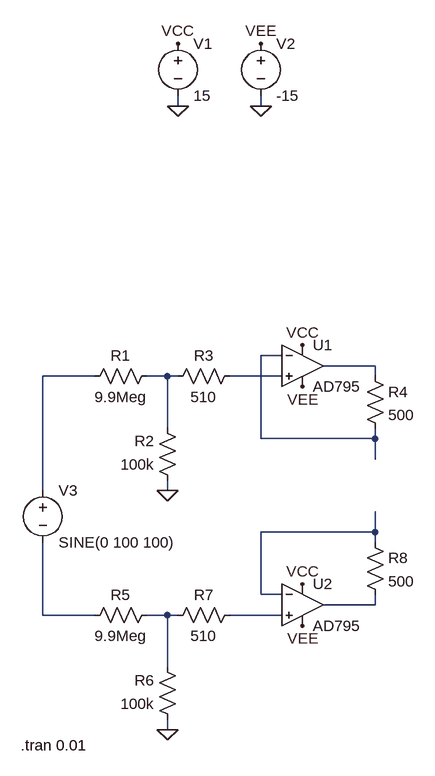
[diagram p0: schematic Draft1.asc]
Draft1.asc, the LTspice schematic file:
Version 4
SHEET 1 880 680
WIRE 32 -320 32 -336
WIRE 160 -320 160 -336
WIRE 192 64 160 64
WIRE 336 80 256 80
WIRE -96 96 -176 96
WIRE 16 96 -16 96
WIRE 32 96 16 96
WIRE 192 96 112 96
WIRE 336 96 336 80
WIRE 16 176 16 96
WIRE 160 192 160 64
WIRE 336 192 336 176
WIRE 336 192 160 192
WIRE 336 224 336 192
WIRE -176 272 -176 96
WIRE 16 272 16 256
WIRE 336 336 336 304
WIRE 336 336 160 336
WIRE 336 352 336 336
WIRE 160 432 160 336
WIRE 192 432 160 432
WIRE 336 448 336 432
WIRE 336 448 256 448
WIRE -176 464 -176 352
WIRE -96 464 -176 464
WIRE 16 464 -16 464
WIRE 32 464 16 464
WIRE 192 464 112 464
WIRE 16 544 16 464
WIRE 16 640 16 624
FLAG 32 -320 0
FLAG 160 -320 0
FLAG 32 -416 VCC
FLAG 224 48 VCC
FLAG 160 -416 VEE
FLAG 224 112 VEE
FLAG 16 272 0
FLAG 224 416 VCC
FLAG 224 480 VEE
FLAG 16 640 0
SYMBOL OpAmps\\AD795 224 16 R0
SYMATTR InstName U1
SYMBOL voltage 32 -432 R0
WINDOW 123 0 0 Left 0
WINDOW 39 0 0 Left 0
SYMATTR InstName V1
SYMATTR Value 15
SYMBOL voltage 160 -432 R0
WINDOW 123 0 0 Left 0
WINDOW 39 0 0 Left 0
SYMATTR InstName V2
SYMATTR Value -15
SYMBOL res 0 80 R90
WINDOW 0 0 56 VBottom 2
WINDOW 3 32 56 VTop 2
SYMATTR InstName R1
SYMATTR Value 9.9Meg
SYMBOL res 32 272 R180
WINDOW 0 36 76 Left 2
WINDOW 3 36 40 Left 2
SYMATTR InstName R2
SYMATTR Value 100k
SYMBOL res 16 112 R270
WINDOW 0 32 56 VTop 2
WINDOW 3 0 56 VBottom 2
SYMATTR InstName R3
SYMATTR Value 510
SYMBOL OpAmps\\AD795 224 384 R0
SYMATTR InstName U2
SYMBOL res 0 448 R90
WINDOW 0 0 56 VBottom 2
WINDOW 3 32 56 VTop 2
SYMATTR InstName R5
SYMATTR Value 9.9Meg
SYMBOL res 32 640 R180
WINDOW 0 36 76 Left 2
WINDOW 3 36 40 Left 2
SYMATTR InstName R6
SYMATTR Value 100k
SYMBOL res 16 480 R270
WINDOW 0 32 56 VTop 2
WINDOW 3 0 56 VBottom 2
SYMATTR InstName R7
SYMATTR Value 510
SYMBOL res 320 336 R0
SYMATTR InstName R8
SYMATTR Value 500
SYMBOL voltage -176 256 R0
WINDOW 123 0 0 Left 0
WINDOW 39 0 0 Left 0
SYMATTR InstName V3
SYMATTR Value SINE(0 100 100)
SYMBOL res 320 80 R0
SYMATTR InstName R4
SYMATTR Value 500
TEXT -210 664 Left 2 !.tran 0.01

The netlist it stands for:
* Draft1.asc
XU1 N005 N001 VCC VEE N002 AD795  ; pins In+ In- V+ V- OUT
V1 VCC 0 15
V2 VEE 0 -15
R1 N004 N003 9.9Meg
R2 0 N004 100k
R3 N004 N005 510
XU2 N010 N006 VCC VEE N007 AD795  ; pins In+ In- V+ V- OUT
R5 N009 N008 9.9Meg
R6 0 N009 100k
R7 N009 N010 510
R8 N006 N007 500
V3 N003 N008 SINE(0 100 100)
R4 N002 N001 500
.tran 0.01
.lib ADI1.lib
.backanno
.end